# Altium schematic sheet simplemesh.SchDoc
size A; SheetNumber: 1; SheetTotal: 1
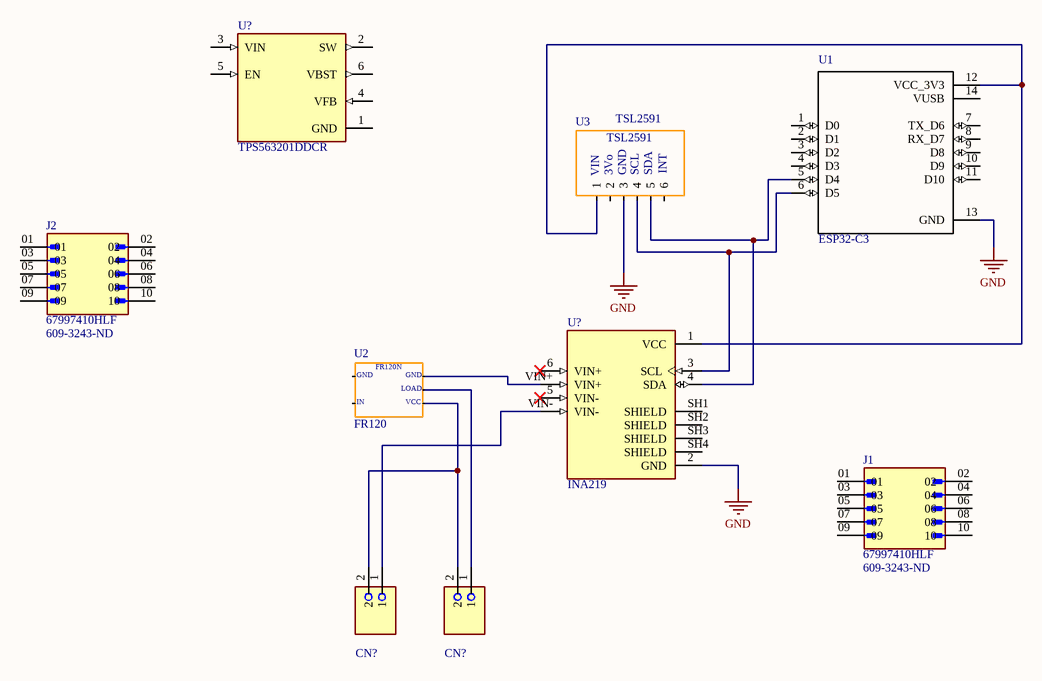
[diagram p0: simplemesh.SchDoc]

## Parts
(Parts that share a designator on the sheet are numbered #1, #2 ... from top to bottom, then left to right.)
CN?#1  ERJ-6ENF5112V  [PHOENIX_1935161]  (value not drawn)
CN?#2  ERJ-6ENF5112V  [PHOENIX_1935161]  (value not drawn)
J1  67997410HLF  Supplier Part Number 1: 609-3243-ND  [AMPHENOL_67997-410HLF]
J2  67997410HLF  Supplier Part Number 1: 609-3243-ND  [AMPHENOL_67997-410HLF]
U1  ESP32-C3  [ESP32-C3]
U2  FR120  [FR120N_Module]
U3  TSL2591  [TSL2591]
U?#1  TPS563201DDCR  [SOT95P280X110-6N]
U?#2  INA219  [INA219]

## Nets
GND: U1.13(GND) U3.3 U?#2.2(GND)
NetCN?#1_1: CN?#1.1 U?#2.VIN-
NetCN?#1_2: CN?#1.2 CN?#2.2 U2.5
NetCN?#2_1: CN?#2.1 U2.4
NetU1_5: U1.5(D4) U3.5 U?#2.4(SDA)
NetU1_6: U1.6(D5) U3.4 U?#2.3(SCL)
NetU1_12: U1.12(VCC_3V3) U3.1 U?#2.1(VCC)
NetU2_3: U2.3 U?#2.VIN+

Not connected (* = marked no-connect by the designer): J1 01 02 03 04 05 06 07 08 09 10; J2 01 02 03 04 05 06 07 08 09 10; U1 1(D0) 2(D1) 3(D2) 4(D3) 7(TX_D6) 8(RX_D7) 9(D8) 10(D9) 11(D10) 14(VUSB); U2 1 2; U3 2 6; U?#1 1(GND) 2(SW) 3(VIN) 4(VFB) 5(EN) 6(VBST); U?#2 5(VIN-)* 6(VIN+)* SH1(SHIELD) SH2(SHIELD) SH3(SHIELD) SH4(SHIELD)

## Notes on the sheet
- (in symbol FR120N_Module) FR120N; GND; LOAD; IN; VCC
- (in symbol TSL2591) 3Vo; GND; SCL; SDA; INT; VIN

## Library data of the parts
CN?#1 CN?#2 = ERJ-6ENF5112V: SMD Chip Resistor, 51.1 kOhm, ± 1%, 125 mW, 0805 [2012 Metric], Thick Film, Precision; Manufacturer: Panasonic; Voltage Rating: 150V; Resistance: 51.1kR; Power Rating: 125mW; Temperature Coefficient: 100ppm/°C; Supplier 1: Mouser; Manufacturer Part Number: ERJ-6ENF5112V; RoHS: Yes; Category: Chip SMD Resistors; Stock 1: 18005; Pricing 1: 1=0.1, 10=0.04, 50=0.04, 100=0.028, 1000=0.017, 10000=0.01 (USD); Mount: Surface Mount; Case/Package: 0805; Contact Plating: Tin; Case Code (Metric): 2012; Case Code (Imperial): 0805; Min Operating Temperature: -55°C; Max Operating Temperature: 155°C; Packaging: Tape and Reel; Termination: SMD/SMT; Series: ERJ; Package Quantity: 5000; Tolerance: 1%; Resistor Type: Thick Film; Number of Terminations: 2; Max Power Dissipation: 125mW; Voltage Rating (DC): 150V; Features: Automotive AEC-Q200; Resistance Tolerance: 1%; Technology: THICK FILM; Length: 2mm; Width: 1.2mm; Height: 0.6mm; Depth: 1.25mm; Height - Seated (Max): 0.028inch; Reach SVHC Compliant: No; Lead Free: Lead Free; RoHS Compliant: Yes; ComponentLink1URL: https://datasheet.ciiva.com/34303/1989447-34303640.pdf?src-supplier=Jameco; ComponentLink1Description: https://datasheet.ciiva.com/34303/1989447-34303640.pdf?src-supplier=Jameco; ComponentLink2URL: https://datasheet.ciiva.com/5969/426256-5969528.pdf?src-supplier=Farnell; ComponentLink2Description: https://datasheet.ciiva.com/5969/426256-5969528.pdf?src-supplier=Farnell; ComponentLink3URL: https://datasheet.ciiva.com/9189/aoa0000ce2-9189038.pdf?src-supplier=Avnet; ComponentLink3Description: https://datasheet.ciiva.com/9189/aoa0000ce2-9189038.pdf?src-supplier=Avnet; ComponentLink4URL: https://datasheet.ciiva.com/28563/1678782-28563625.pdf?src-supplier=Element14; ComponentLink4Description: https://datasheet.ciiva.com/28563/1678782-28563625.pdf?src-supplier=Element14; ComponentLink5URL: https://datasheet.ciiva.com/28693/1678782-28693606.pdf?src-supplier=Element14; ComponentLink5Description: https://datasheet.ciiva.com/28693/1678782-28693606.pdf?src-supplier=Element14; ComponentLink6URL: https://datasheet.ciiva.com/46389/426256-46389422.pdf?src-supplier=Element14; ComponentLink6Description: https://datasheet.ciiva.com/46389/426256-46389422.pdf?src-supplier=Element14; ComponentLink7URL: https://datasheet.ciiva.com/24026/aoa0000ce2-24026453.pdf?src-supplier=Mouser; ComponentLink7Description: https://datasheet.ciiva.com/24026/aoa0000ce2-24026453.pdf?src-supplier=Mouser; ComponentLink8URL: https://datasheet.ciiva.com/16772/70260748-16772970.pdf?src-supplier=Allied+Electronics; ComponentLink8Description: https://datasheet.ciiva.com/16772/70260748-16772970.pdf?src-supplier=Allied+Electronics; ComponentLink9URL: https://datasheet.ciiva.com/16760/70260748-16760759.pdf?src-supplier=Allied+Electronics; ComponentLink9Description: https://datasheet.ciiva.com/16760/70260748-16760759.pdf?src-supplier=Allied+Electronics; ComponentLink10URL: https://datasheet.ciiva.com/30097/aoa0000ce2-30097854.pdf?src-supplier=Onlinecomponents.com; ComponentLink10Description: https://datasheet.ciiva.com/30097/aoa0000ce2-30097854.pdf?src-supplier=Onlinecomponents.com; Supplier Part Number 1: 667-ERJ-6ENF5112V
J1 J2 = 67997410HLF: Board Connector, 66 Contact(s), 2 Row(s), Male, Straight, Solder Terminal; Manufacturer: Amphenol Communications Solutions; Supplier 1: Digikey; Manufacturer Part Number: 67997410HLF; RoHS: No; Stock 1: 5093; Pricing 1: 1=0.28, 10=0.241, 100=0.2048, 500=0.18272, 1000=0.17399, 5000=0.1553, 10000=0.14789 (USD); ComponentLink1URL: https://datasheet.octopart.com/67997-410HLF-Amphenol-Communications-Solutions-datasheet-10288749.pdf?src-supplier=Farnell; ComponentLink1Description: https://datasheet.octopart.com/67997-410HLF-Amphenol-Communications-Solutions-datasheet-10288749.pdf?src-supplier=Farnell; ComponentLink2URL: https://datasheet.octopart.com/67997-410HLF-Areva-datasheet-15888151.pdf?src-supplier=Element14; ComponentLink2Description: https://datasheet.octopart.com/67997-410HLF-Areva-datasheet-15888151.pdf?src-supplier=Element14; ComponentLink3URL: https://datasheet.octopart.com/67997-410HLF-Amphenol-Communications-Solutions-datasheet-36854132.pdf?src-supplier=Electro+Sonic; ComponentLink3Description: https://datasheet.octopart.com/67997-410HLF-Amphenol-Communications-Solutions-datasheet-36854132.pdf?src-supplier=Electro+Sonic
U2 = FR120N_Module
U?#1 = TPS563201DDCR: 4.5 V to 17 V input, 3 A output, synchronous step-down converter in Eco-mode; MF: Texas Instruments; Value: *; Availability: In Stock; Check_prices: https://www.snapeda.com/parts/TPS563201DDCR/Texas+Instruments/view-part/?ref=eda; Price: None; SnapEDA_Link: https://www.snapeda.com/parts/TPS563201DDCR/Texas+Instruments/view-part/?ref=snap; Purchase-URL: https://pricing.snapeda.com/search/part/TPS563201DDCR/?ref=eda; Package: SOT-23-THN-6 Texas Instruments; MP: TPS563201DDCR
U?#2 = INA219: MF: Adafruit Industries; MP: 904; Package: None; Price: None; Value: *; Availability: Unavailable
U1 = ESP32-C3: SnapEDA_Link: https://www.snapeda.com/parts/113991054/Seeed+Studio/view-part/?ref=snap; Check_prices: https://www.snapeda.com/parts/113991054/Seeed+Studio/view-part/?ref=eda; Value: *